# EAGLE design ESP8223_Releay Board (EAGLE 8.3.2)
Moduł wykonawczy sterowania akwarium
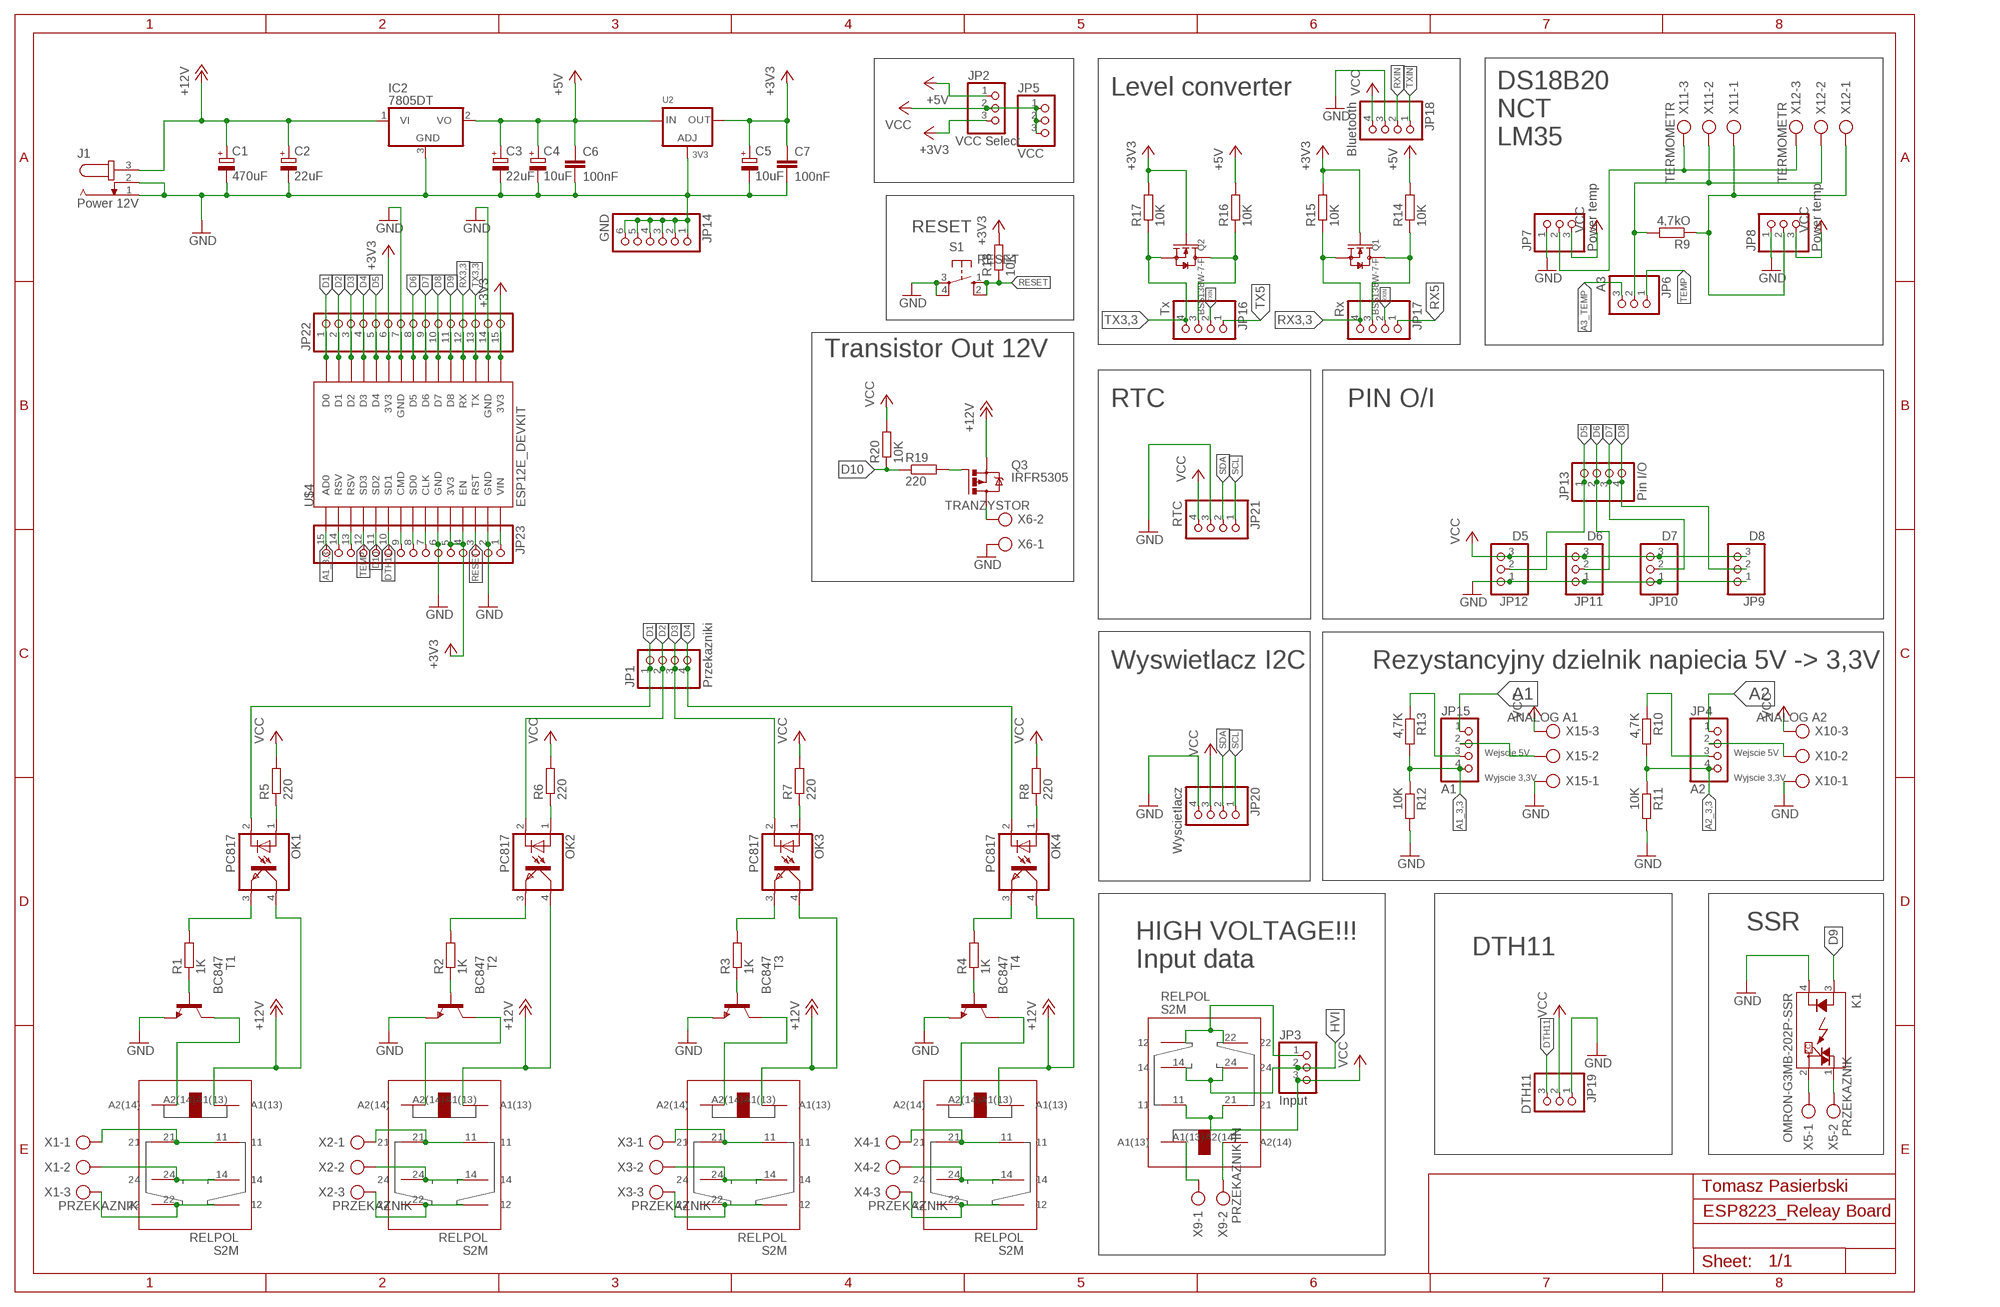
[diagram p0: schematic, sheet 1]

## Parts
C1  470uF  CPOL-EUE5-8.5  [E5-8,5]
C2  22uF  CPOL-EUE2.5-6  [E2,5-6]
C3  22uF  CPOL-EUE2.5-6  [E2,5-6]
C4  10uF  CPOL-EU153CLV-0810  [153CLV-0810]
C5  10uF  CPOL-EU153CLV-0810  [153CLV-0810]
C6  100nF  C-EUC1206K  [C1206K]
C7  100nF  C-EUC1206K  [C1206K]
IC2  7805DT  [TO252]
J1  Power 12V  JACK-PLUG0  [SPC4077]
JP1  Przekazniki  PINHD-1X4  [1X04]
JP2  VCC Select  PINHD-1X3  [1X03]
JP3  Input  PINHD-1X3  [1X03]
JP4  A2  PINHD-1X4  [1X04]
JP5  VCC  PINHD-1X3  [1X03]
JP6  A3  PINHD-1X3  [1X03]
JP7  Power temp  PINHD-1X3  [1X03]
JP8  Power temp  PINHD-1X3  [1X03]
JP9  D8  PINHD-1X3  [1X03]
JP10  D7  PINHD-1X3  [1X03]
JP11  D6  PINHD-1X3  [1X03]
JP12  D5  PINHD-1X3  [1X03]
JP13  Pin I/O  PINHD-1X4  [1X04]
JP14  GND  PINHD-1X6  [1X06]
JP15  A1  PINHD-1X4  [1X04]
JP16  Tx  PINHD-1X4  [1X04]
JP17  Rx  PINHD-1X4  [1X04]
JP18  Bluetooth  PINHD-1X4  [1X04]
JP19  DTH11  PINHD-1X3  [1X03]
JP20  Wyscietlacz  PINHD-1X4  [1X04]
JP21  RTC  PINHD-1X4  [1X04]
JP22  PINHD-1X15  [1X15]
JP23  PINHD-1X15  [1X15]
K1  OMRON-G3MB-202P-SSR  [OMRON-G3MB-202P-SSR]
OK1  PC817  [DIL04]
OK2  PC817  [DIL04]
OK3  PC817  [DIL04]
OK4  PC817  [DIL04]
Q1  BSS138W-7-F  SMD-MOSFET-N-CH-50V-200MA-BSS138W-7-F(SOT-23)  [SOT-23]
Q2  BSS138W-7-F  SMD-MOSFET-N-CH-50V-200MA-BSS138W-7-F(SOT-23)  [SOT-23]
Q3  IRFR5305  [D-PAK_TO252AA]
R1  1K  R-EU_R1206W  [R1206W]
R2  1K  R-EU_R1206W  [R1206W]
R3  1K  R-EU_R1206W  [R1206W]
R4  1K  R-EU_R1206W  [R1206W]
R5  220  R-EU_R1206W  [R1206W]
R6  220  R-EU_R1206W  [R1206W]
R7  220  R-EU_R1206W  [R1206W]
R8  220  R-EU_R1206W  [R1206W]
R9  4,7kO  R-EU_R1206W  [R1206W]
R10  4,7K  R-EU_R1206W  [R1206W]
R11  10K  R-EU_R1206W  [R1206W]
R12  10K  R-EU_R1206W  [R1206W]
R13  4,7K  R-EU_R1206W  [R1206W]
R14  10K  R-EU_R1206W  [R1206W]
R15  10K  R-EU_R1206W  [R1206W]
R16  10K  R-EU_R1206W  [R1206W]
R17  10K  R-EU_R1206W  [R1206W]
R18  10K  R-EU_R1206W  [R1206W]
R19  220  R-EU_R1206W  [R1206W]
R20  10K  R-EU_R1206W  [R1206W]
S1  RESET  40-XX  [B3F-40XX]
T1  BC847  [SOT23]
T2  BC847  [SOT23]
T3  BC847  [SOT23]
T4  BC847  [SOT23]
U2  3V3  LM1117SOT223-WAVE  [SOT223-W]
U4  RELPOL_S2M  [S2M]
U$1  RELPOL_S2M  [S2M]
U$2  RELPOL_S2M  [S2M]
U$3  RELPOL_S2M  [S2M]
U$4  ESP12E_DEVKIT  [ESP12E_DEVKIT]
U$5  RELPOL_S2M  [S2M]
X1  PRZEKAZNIK  AK300/3  [AK300/3]
X2  PRZEKAZNIK  AK300/3  [AK300/3]
X3  PRZEKAZNIK  AK300/3  [AK300/3]
X4  PRZEKAZNIK  AK300/3  [AK300/3]
X5  PRZEKAZNIK  AK300/2  [AK300/2]
X6  TRANZYSTOR  AK300/2  [AK300/2]
X9  PRZEKAZNIK IN  AK300/2  [AK300/2]
X10  ANALOG A2  AK300/3  [AK300/3]
X11  TERMOMETR  AK300/3  [AK300/3]
X12  TERMOMETR  AK300/3  [AK300/3]
X15  ANALOG A1  AK300/3  [AK300/3]

## Nets
+3V3: C5.+ C7.1 JP2.3 JP22.6 JP22.15 JP23.4 JP23.5 Q1.1(G) Q2.1(G) R15.2 R17.2 R18.2 U2.2(OUT) U$4.3V3@0(3V3) U$4.3V3@1(3V3) U$4.3V3@2(3V3) U$4.EN
+5V: C3.+ C4.+ C6.1 IC2.2(VO) JP2.1 R14.2 R16.2 U2.3(IN)
+12V: C1.+ C2.+ IC2.1(VI) J1.3 OK1.4(COL) OK2.4(COL) OK3.4(COL) OK4.4(COL) Q3.3(S) U4.A1(13) U$1.A1(13) U$2.A1(13) U$3.A1(13)
A1: JP15.1
A1_3,3: JP15.4 JP23.15 R12.1 R13.2 U$4.AD0
A2: JP4.1
A2_3,3: JP4.4 R10.2 R11.1
A3_TEMP: JP6.3
D1: JP1.1 JP22.1 OK1.2(C) U$4.D0
D2: JP1.2 JP22.2 OK2.2(C) U$4.D1
D3: JP1.3 JP22.3 OK3.2(C) U$4.D2
D4: JP1.4 JP22.4 OK4.2(C) U$4.D3
D5: JP12.2 JP13.1 JP22.5 U$4.D4
D6: JP11.2 JP13.2 JP22.8 U$4.D5
D7: JP10.2 JP13.3 JP22.9 U$4.D6
D8: JP9.2 JP13.4 JP22.10 U$4.D7
D9: JP22.11 K1.3(A) U$4.D8
D10: JP23.11 R19.1 R20.1 U$4.SD2
DTH11: JP19.3 JP23.10 U$4.SD1
GND: C1.- C2.- C3.- C4.- C5.- C6.2 C7.2 IC2.3(GND) J1.1 J1.2 JP7.1 JP8.1 JP9.1 JP10.1 JP11.1 JP12.1 JP14.1 JP14.2 JP14.3 JP14.4 JP14.5 JP14.6 JP18.3 JP19.1 JP20.4 JP21.3 JP22.7 JP22.14 JP23.2 JP23.6 K1.4(K) R11.2 R12.2 S1.3(P) S1.4(P1) T1.2(E) T2.2(E) T3.2(E) T4.2(E) U2.1(ADJ) U$4.GND@0(GND) U$4.GND@1(GND) U$4.GND@2(GND) U$4.GND@3(GND) X6.1 X10.1 X15.1
HVI: JP3.2 U$5.14 U$5.24
N$1: JP23.1 U$4.VIN
N$2: Q3.1(G) R19.2
N$3: JP23.7 U$4.CLK
N$4: JP23.8 U$4.SD0
N$5: OK1.1(A) R5.1
N$6: OK2.1(A) R6.1
N$7: OK3.1(A) R7.1
N$8: OK4.1(A) R8.1
N$9: JP3.1 U$5.12 U$5.22
N$10: T2.3(C) U$1.A2(14)
N$11: T3.3(C) U$2.A2(14)
N$12: T4.3(C) U$3.A2(14)
N$13: JP23.9 U$4.CMD
N$14: T1.3(C) U4.A2(14)
N$15: JP4.2 X10.2
N$16: JP23.13 U$4.RSV@1(RSV)
N$17: U$5.A1(13) X9.1
N$18: R1.1 T1.1(B)
N$19: R2.1 T2.1(B)
N$20: R3.1 T3.1(B)
N$21: R4.1 T4.1(B)
N$22: OK1.3(EMIT) R1.2
N$23: OK2.3(EMIT) R2.2
N$24: OK3.3(EMIT) R3.2
N$25: OK4.3(EMIT) R4.2
N$26: U$5.A2(14) X9.2
N$27: JP15.2 X15.2
N$28: JP23.14 U$4.RSV@0(RSV)
N$29: U$3.11 U$3.21 X4.1
N$31: JP17.3 Q1.3(D) R14.1
N$32: U$3.14 U$3.24 X4.2
N$33: U$3.12 U$3.22 X4.3
N$35: Q3.4(D) X6.2
N$36: JP16.3 Q2.3(D) R16.1
N$37: JP7.2 X11.3 X12.3
N$38: U4.11 U4.21 X1.1
N$39: U4.14 U4.24 X1.2
N$40: U4.12 U4.22 X1.3
N$41: K1.2(DS2) X5.1
N$43: K1.1(DS1) X5.2
N$44: U$1.11 U$1.21 X2.1
N$45: U$1.14 U$1.24 X2.2
N$46: U$1.12 U$1.22 X2.3
N$50: U$2.11 U$2.21 X3.1
N$51: U$2.14 U$2.24 X3.2
N$52: U$2.12 U$2.22 X3.3
N$56: JP6.2 R9.2 X11.2 X12.2
N$57: JP8.2 R9.1 X11.1 X12.1
N$67: JP4.3 R10.1
N$68: JP15.3 R13.1
RESET: JP23.3 R18.1 S1.1(S) S1.2(S1) U$4.RST
RX3,3: JP17.4 JP22.12 Q1.2(S) R15.1 U$4.RX
RX5: JP17.1
RXIN: JP17.2 JP18.2
SCL: JP20.1 JP21.1
SDA: JP20.2 JP21.2
TEMP: JP6.1 JP23.12 U$4.SD3
TX3,3: JP16.4 JP22.13 Q2.2(S) R17.1 U$4.TX
TX5: JP16.1
TXIN: JP16.2 JP18.1
VCC: JP2.2 JP3.3 JP5.1 JP5.2 JP5.3 JP7.3 JP8.3 JP9.3 JP10.3 JP11.3 JP12.3 JP18.4 JP19.2 JP20.3 JP21.4 R5.2 R6.2 R7.2 R8.2 R20.2 U$5.11 U$5.21 X10.3 X15.3

## Notes on the sheet
- Level converter
- DS18B20
  NCT
  LM35
- RESET
- Transistor Out 12V
- RTC | PIN O/I
- Wyswietlacz I2C | Rezystancyjny dzielnik napiecia 5V -> 3,3V
- Wejscie 5V | Wejscie 5V
- Wyjscie 3,3V | Wyjscie 3,3V
- SSR
- DTH11
- HIGH VOLTAGE!!!
  Input data
- Tomasz Pasierbski

## Library data of the parts
C1-C5 = rcl:CPOL-EU: POLARIZED CAPACITOR, European symbol
C6 C7 = rcl:C-EU: CAPACITOR, European symbol
IC2 = linear:78*: Positive VOLTAGE REGULATOR Source: http://cache.national.com/ds/LM/LM78L05.pdf http://www.fairchildsemi.com/ds/LM/LM7805.pdf
J1 = con-jack:JACK-PLUG: DC POWER JACK Power Jack, DC, Right Angle, Through Hole, Rated 5A at 16VDC, PC Terminals Distributor: Farnell (www.Farnell.de) Drawing: 84N1161.pdf / 84N1162.pdf Manufacturer: SPC Technology (www.spctechnology.com) Type: SPC4077 / SPC 4078; OC_FARNELL: unknown; OC_NEWARK: unknown
JP1 JP4 JP13 JP15-JP18 JP20 JP21 = pinhead:PINHD-1X4: PIN HEADER
JP2 JP3 JP5-JP12 JP19 = pinhead:PINHD-1X3: PIN HEADER
JP14 = pinhead:PINHD-1X6: PIN HEADER
JP22 JP23 = pinhead:PINHD-1X15: PIN HEADER
K1 = Omron G3MB 202p SSR:OMRON-G3MB-202P-SSR: IT(rms) 8A, Zero Cross type SIP 4pin Triac output SSR Source: http://sharp-world.com/products/device/lineup/data/pdf/datasheet/s102s02_e.pdf
OK1-OK4 = optocoupler:PC817: SHARP OPTO COUPLER; MPN: PC817X4J000F; OC_FARNELL: 9707727; OC_NEWARK: 97K7059
Q1 Q2 = Seeed-Transistor:SMD-MOSFET-N-CH-50V-200MA-BSS138W-7-F(SOT-23): 305030000; MPN: BSS138W-7-F
Q3 = transistor-power:IRF?5305: HEXFET Power MOSFET Source: http://www.irf.com/product-info/datasheets/data/irfr5305pbf.pdf
R1-R20 = rcl:R-EU_: RESISTOR, European symbol
S1 = adafruit:40-XX: OMRON SWITCH; MF: OMRON COMPONENTS USA; MPN: B3F-4000; OC_FARNELL: 176434; OC_NEWARK: 36K3105
T1-T4 = transistor:BC847: NPN TRANSISTOR
U2 = microbuilder:LM1117: LM1117 Voltage Regulator LM1117 Adjustable Voltage regulator [Digikey: LM1117IMP-ADJDKR-ND] LM1117 3.3V Voltage regulator [AP1117E33GDIDKR-ND] LM1117 5.0V Voltage regulator [AP1117E50GDIDKR-ND] SOT223-REFLOW - SOT223 package for solder paste/reflow ovens SOT223-WAVE - SOT223 package for hand-soldering (larger pads) Note: For the fixed-voltage regulators, simply set the ADJ pin to GND.
U4 U$1-U$3 U$5 = Relpol_S2M:RELPOL_S2M
U$4 = ESP12E_DEVKIT:ESP12E_DEVKIT: ESP12E DEVKIT BOARD
X1-X4 X10-X12 X15 = con-ptr500:AK300/3: CONNECTOR; OC_FARNELL: unknown; OC_NEWARK: unknown
X5 X6 X9 = con-ptr500:AK300/2: CONNECTOR; OC_FARNELL: unknown; OC_NEWARK: unknown

## Board
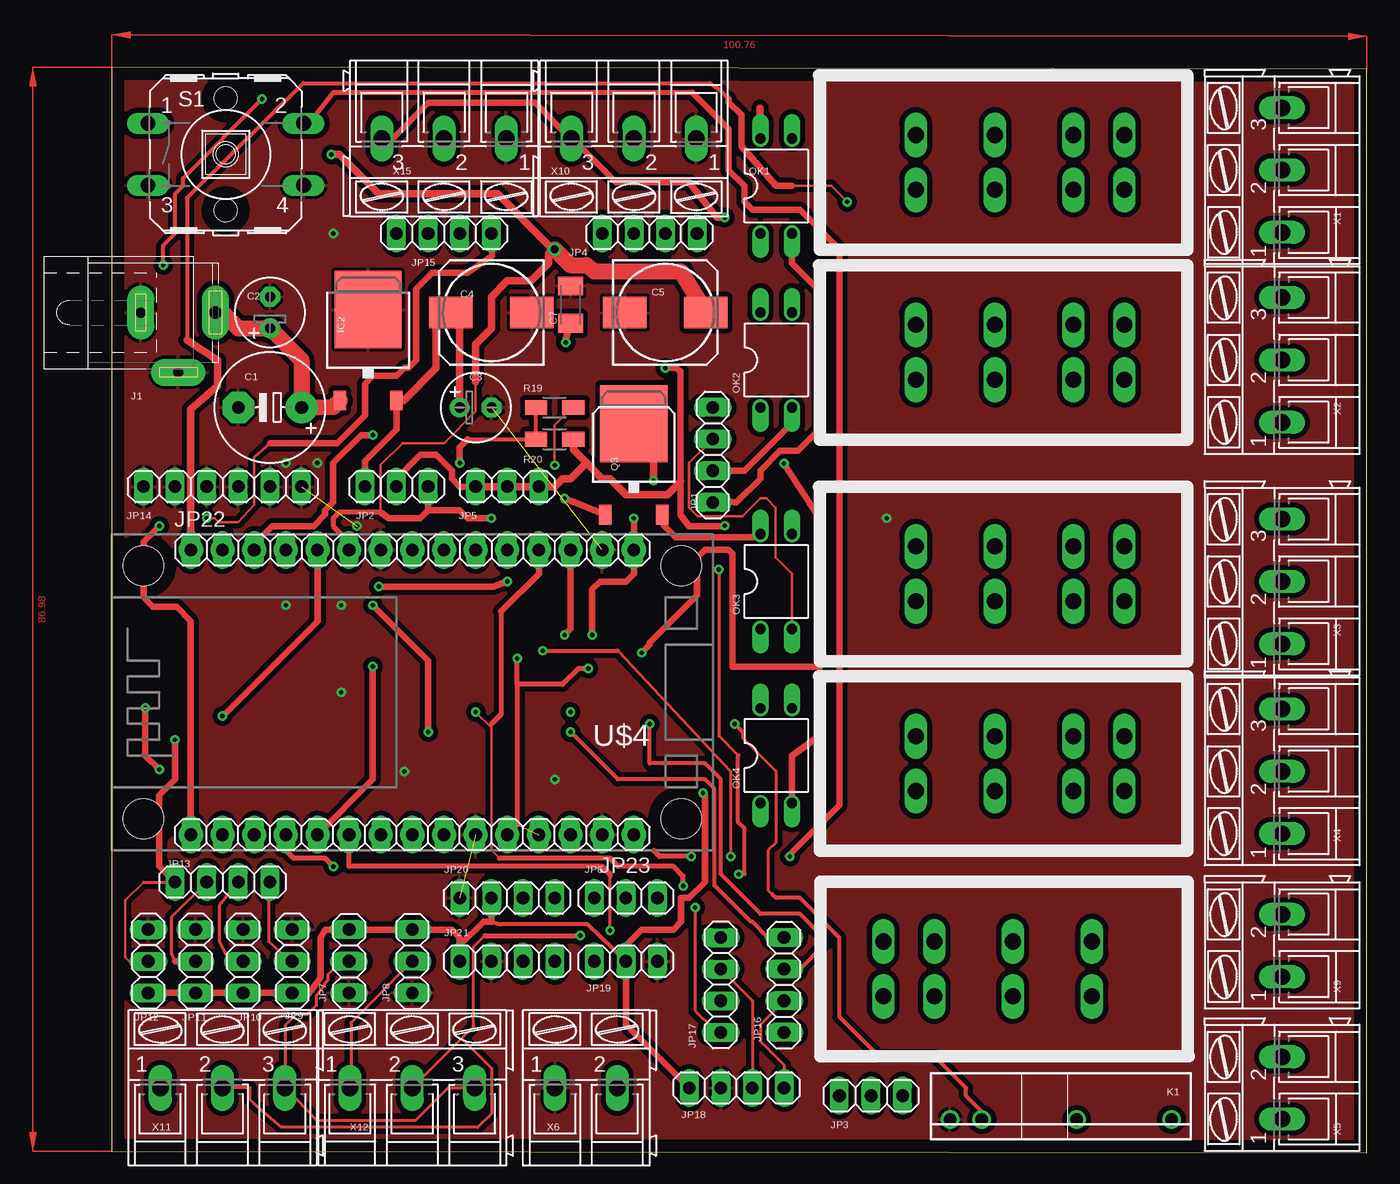
[diagram p1: board, top side]
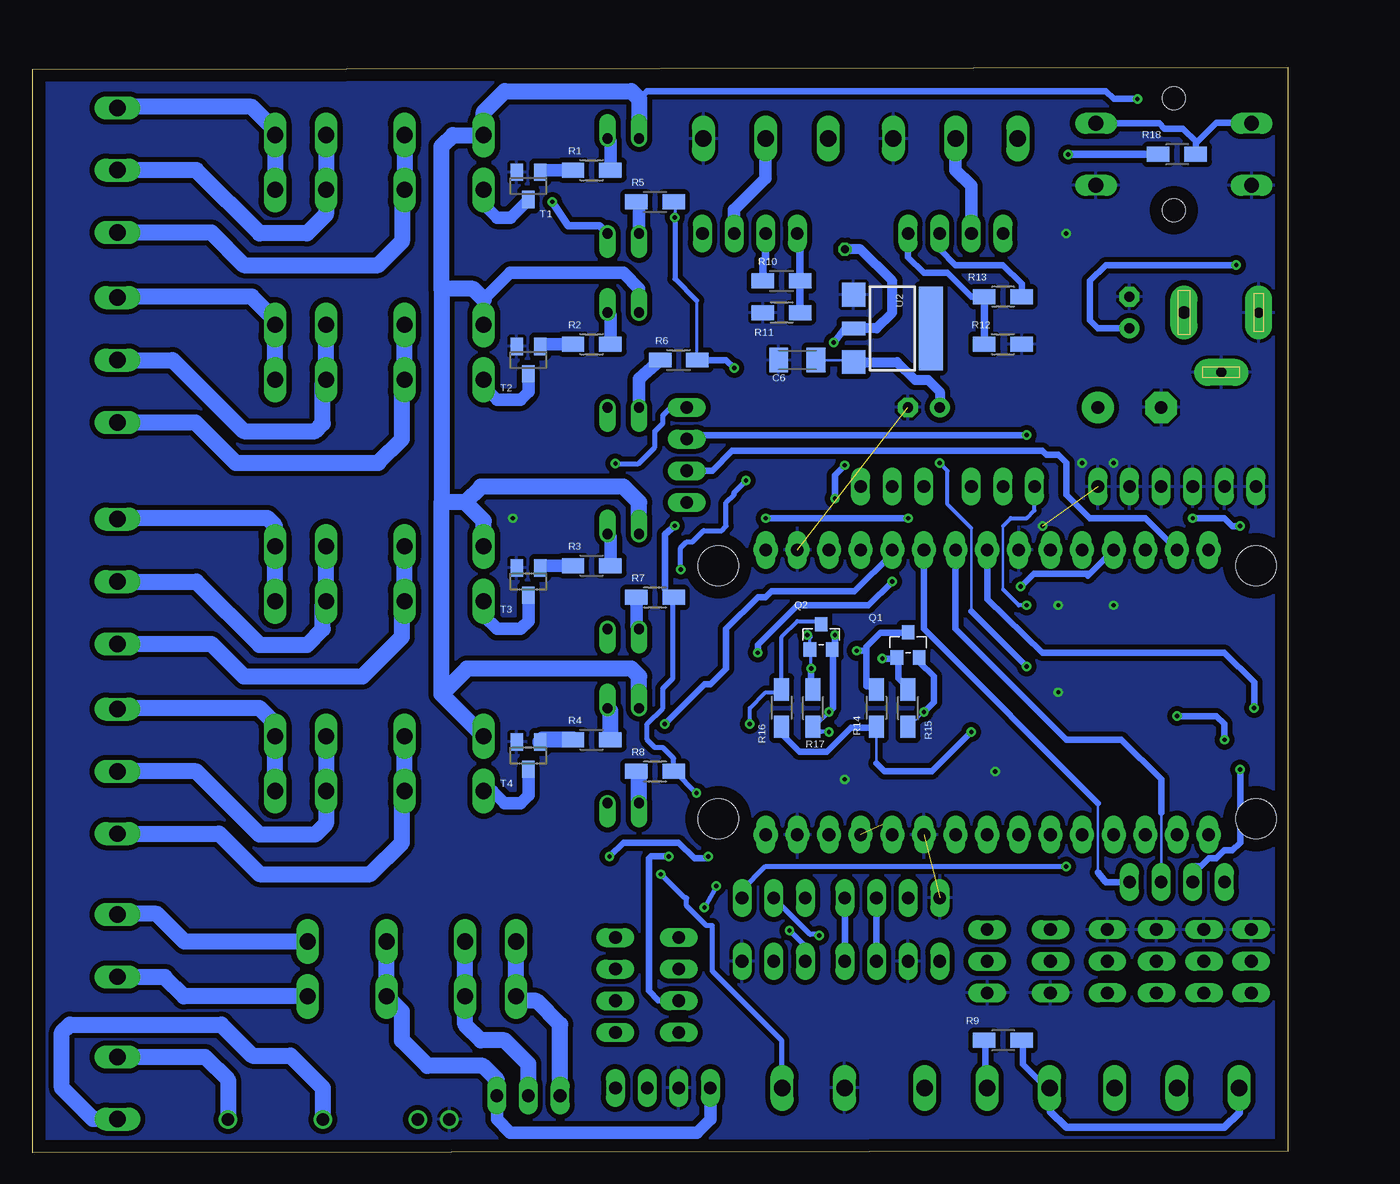
[diagram p2: board, bottom side, seen from below]

Size 100.76 x 87.11 mm. Coordinates in mm from the lower left corner, seen from the top.
Outline: 0,0.13 100.76,0 100.76,86.98 0,87.11 0,0.13
Copper layers (1*16): Top 0.035mm / dielectric 1.5mm / Bottom 0.035mm
Design rules "default *": minimum track width 8mil, minimum drill 0.35mm, track to track 8mil, track to pad 8mil, pad to pad 8mil, via to via 8mil, smd to smd 8mil, copper to edge 40mil, drill to drill 12mil, minimum pad ring 10mil, minimum via ring 8mil, stop-mask expansion 4mil, vias tented up to drill 0mil, thermal gap 10mil

### Footprints (pad centres in the part's own frame; a part is rotated, then mirrored left to right if it is on the bottom)
E5-8,5 = drill 1.016 pad 2.54: + -2.54,0 | drill 1.016 pad 2.54 octagon: - 2.54,0
E2,5-6 = drill 0.813 pad 1.6: + -1.27,0 | drill 0.813 pad 1.6 octagon: - 1.27,0
153CLV-0810 = smd 3.5 x 2.5: + 3.25,0; - -3.25,0
C1206K = smd 1.5 x 2: 1 -1.5,0; 2 1.5,0
TO252 = smd 1 x 1.6: 1 -2.28,-4.8; 2 2.28,-4.8 | smd 5.4 x 6.2: 3 0,2.5
SPC4077 = drill 0.8 pad 2.184 long: 1 -3,0; 2 0,-4.8 | drill 1 pad 2.184 long: 3 3,0
1X04 = drill 1.016 long: 1 -3.81,0; 2 -1.27,0; 3 1.27,0; 4 3.81,0
1X03 = drill 1.016 long: 1 -2.54,0; 2 0,0; 3 2.54,0
1X06 = drill 1.016 long: 1 -6.35,0; 2 -3.81,0; 3 -1.27,0; 4 1.27,0; 5 3.81,0; 6 6.35,0
1X15 = drill 1.016 long: 1 -17.78,0; 2 -15.24,0; 3 -12.7,0; 4 -10.16,0; 5 -7.62,0; 6 -5.08,0; 7 -2.54,0; 8 0,0; 9 2.54,0; 10 5.08,0; 11 7.62,0; 12 10.16,0; 13 12.7,0; 14 15.24,0; 15 17.78,0
OMRON-G3MB-202P-SSR = drill 1: 1 -10.16,0; 2 -2.54,0; 3 5.08,0; 4 7.62,0
DIL04 = drill 0.813 offset: 1 -1.27,-3.81; 2 1.27,-3.81; 3 1.27,3.81; 4 -1.27,3.81
SOT-23 = smd 1.016 x 1.143: 1 -0.889,-1.016; 2 0.889,-1.016; 3 0,1.016
D-PAK_TO252AA = smd 1 x 1.6: 1 -2.28,-4.8; 3 2.28,-4.8 | smd 5.4 x 6.2: 4 0,2.5
R1206W = smd 1.8 x 1.2: 1 -1.499,0; 2 1.499,0
B3F-40XX = drill 1.194 long: 1 -6.248,2.489; 2 6.248,2.489; 3 -6.248,-2.489; 4 6.248,-2.489 | hole 1.803: 0,-4.496; 0,4.496
SOT23 = smd 1 x 1.4: 1 -0.95,-1.1; 2 0.95,-1.1; 3 0,1.1
SOT223-W = smd 1.9 x 1.9: 1 -2.7,-3.1; 3 2.7,-3.1 | smd 1.1 x 1.9: 2 0,-3.1 | smd 6.7 x 1.9: 4 0,3.1
S2M = drill 1.3 long: 11 4.8,-15.45; 12 4.8,-5.05; 14 4.8,-9.15; 21 9.2,-15.45; 22 9.2,-5.05; 24 9.2,-9.15; A1(13) 4.8,-21.8; A2(14) 9.2,-21.8
ESP12E_DEVKIT = drill 0.8 pad 1.93: 3V3@0 -11.43,-7.62; 3V3@1 11.43,5.08; 3V3@2 11.43,-17.78; AD0 -11.43,17.78; CLK -11.43,-2.54; CMD -11.43,2.54; D0 11.43,17.78; D1 11.43,15.24; D2 11.43,12.7; D3 11.43,10.16; D4 11.43,7.62; D5 11.43,0; D6 11.43,-2.54; D7 11.43,-5.08; D8 11.43,-7.62; EN -11.43,-10.16; GND@0 -11.43,-5.08; GND@1 -11.43,-15.24; GND@2 11.43,2.54; GND@3 11.43,-15.24; RST -11.43,-12.7; RSV@0 -11.43,15.24; RSV@1 -11.43,12.7; RX 11.43,-10.16; SD0 -11.43,0; SD1 -11.43,5.08; SD2 -11.43,7.62; SD3 -11.43,10.16; TX 11.43,-12.7; VIN -11.43,-17.78 | hole 3.2: -10.16,21.59; 10.16,21.59; 10.16,-21.59; -10.16,-21.59
AK300/3 = drill 1.321 long: 1 -5.004,0; 2 0,0; 3 5.004,0
AK300/2 = drill 1.321 long: 1 -2.515,0; 2 2.489,0

### Placement (x,y rotation side)
C1  12.7,59.82 180 top
C2  12.7,67.44 90 top
C3  29.21,59.82 0 top
C4  30.48,67.44 180 top
C5  44.45,67.44 0 top
C6  39.37,63.63 180 bottom
C7  36.83,68.07 90 top
IC2  20.58,65.18 0 top
J1  5.33,67.44 0 top
JP1  48.26,56.01 90 top
JP2  22.86,53.47 0 top
JP3  60.96,4.57 0 top
JP4  43.18,73.79 180 top
JP5  31.75,53.47 0 top
JP6  41.27,20.45 180 top
JP7  19.05,15.37 90 top
JP8  24.13,15.37 90 top
JP9  14.48,15.37 270 top
JP10  10.54,15.37 270 top
JP11  6.73,15.37 270 top
JP12  2.92,15.37 270 top
JP13  8.89,21.72 0 top
JP14  8.89,53.47 0 top
JP15  26.67,73.79 0 top
JP16  53.98,13.46 90 top
JP17  48.9,13.46 270 top
JP18  50.16,5.21 180 top
JP19  41.27,15.37 180 top
JP20  31.75,20.45 180 top
JP21  31.75,15.37 180 top
JP22  24.13,48.39 0 top
JP23  24.13,25.53 180 top
K1  74.93,2.67 180 top
OK1  53.34,77.6 0 top
OK2  53.34,63.63 0 top
OK3  53.34,45.85 0 top
OK4  53.34,31.88 0 top
Q1  30.48,40.77 0 bottom
Q2  37.47,41.4 0 bottom
Q3  41.91,56.01 0 top
R1  55.88,78.87 0 bottom
R2  55.88,64.9 0 bottom
R3  55.88,47.12 0 bottom
R4  55.88,33.15 0 bottom
R5  50.8,76.33 0 bottom
R6  48.9,63.63 0 bottom
R7  50.8,44.58 0 bottom
R8  50.8,30.61 0 bottom
R9  22.86,9.02 180 bottom
R10  40.64,69.98 0 bottom
R11  40.64,67.44 180 bottom
R12  22.86,64.9 0 bottom
R13  22.86,68.71 180 bottom
R14  33.02,35.69 270 bottom
R15  30.48,35.69 90 bottom
R16  40.64,35.69 270 bottom
R17  38.1,35.69 90 bottom
R18  8.89,80.14 180 bottom
R19  35.56,59.82 0 top
R20  35.56,57.28 0 top
S1  9.14,80.14 0 top
T1  60.96,77.6 180 bottom
T2  60.96,63.63 180 bottom
T3  60.96,45.85 180 bottom
T4  60.96,31.88 180 bottom
U2  31.75,66.17 270 bottom
U4  86.36,86.49 270 top
U$1  86.36,71.25 270 top
U$2  86.36,53.47 270 top
U$3  86.36,38.23 270 top
U$4  24.13,36.96 90 top
U$5  56.9,7.75 90 top
X1  93.98,78.87 90 top
X2  93.98,63.63 90 top
X3  93.98,45.85 90 top
X4  93.98,30.61 90 top
X5  93.98,5.21 90 top
X6  38.1,5.21 0 top
X9  93.98,16.64 90 top
X10  41.91,81.41 180 top
X11  8.89,5.21 0 top
X12  24.13,5.21 0 top
X15  26.67,81.41 180 top

### Tracks (layer width: path | path; a pad name or v marks a point on that pad's centre or on a via)
+3V3  (via drill 0.35, 0.65)  (1 unrouted)
  Top 0.203: 29.21,61.88 29.21,59.5 26.67,56.96 23.37,56.96 21.6,55.21 21.6,51.4 | 35.08,72.2 v35.56,72.52
  Top 0.305: 41.91,49.02 U$4.3V3@2
  Top 0.406: 32.54,37.59 32.54,26.32 U$4.3V3@0 | 32.54,37.59 v32.54,39.66 | v38.26,38.86 37.47,38.86 36.2,37.59 32.54,37.59 | 21.6,51.4 18.26,51.4 17.78,50.93 17.78,50.29 18.41,49.66 18.92,49.66 19.05,49.53
  Top 0.508: v38.58,41.56 38.58,45.21 39.21,45.85 41.27,45.85 41.91,46.48 U$4.3V3@2 v41.91,50.93 | v36.45,65.02 36.45,65.25 C7.1 | 19.05,49.53 U$4.3V3@1 | 25.4,51.56 24.77,50.93 22.23,50.93 21.6,51.4 | 25.4,51.56 JP2.3 | v30.48,50.93 28.57,50.93 27.94,51.56 25.4,51.56
  Top 0.61: v17.62,80.14 18.26,80.14 21.43,76.96 30.96,76.96 35.08,72.83 v35.56,72.52 | 29.21,61.88 29.21,64.9 30.48,66.17 30.48,68.71 31.75,69.98 33.66,69.98 35.08,71.41 35.08,72.2
  Top 1.27: v35.56,72.52 36.83,71.25 38.1,71.25 38.73,70.74 45.66,70.74 C5.+
  Bottom 0.203: 38.26,37.43 38.1,37.28 R17.2 | 31.27,39.66 Q1.1
  Bottom 0.254: v38.26,38.86 38.26,40.29 Q2.1 38.42,40.45 38.42,41.4 | 30.48,37.28 R15.2 | 31.43,39.66 Q1.1
  Bottom 0.508: 38.26,37.43 v38.26,38.86 | 31.27,39.66 31.27,38.07 30.48,37.28 | v32.54,39.66 31.43,39.66 | v38.58,41.56 38.42,41.4 | U2.2 35.56,66.17 v36.45,65.02 | v41.91,50.93 v30.48,50.93
  Bottom 0.61: v17.62,80.14 R18.2
  Bottom 0.813: U2.2 33.02,66.17 31.75,67.44 31.75,69.98 34.29,72.52 v35.56,72.52
+5V  (via drill 0.35)
  Top 0.508: IC2.2 22.86,58.07 20.32,55.53 JP2.1 | v25.4,33.78 25.4,39.5 v20.95,43.94
  Top 0.61: IC2.2 23.42,60.38 26.04,62.99 26.04,66.24 C4.+ | 27.23,66.88 27.94,66.17 C3.+
  Top 1.27: C4.+ 27.23,66.88
  Bottom 0.203: 33.02,34.1 R14.2 33.02,31.24 | C6.1 35.4,63.63 U2.3 | 22.86,45.21 22.86,50.29
  Bottom 0.305: v20.95,43.94 21.59,43.94 22.86,45.21 | 22.86,50.29 22.23,50.93 20.95,50.93 20.32,51.56 JP2.1
  Bottom 0.508: 33.02,34.1 35.08,34.1 36.99,32.2 39.21,32.2 40.64,33.62 R16.2 | 33.02,31.24 32.38,30.61 28.57,30.61 v25.4,33.78
  Bottom 0.813: U2.3 31.36,63.47 29.93,62.03 28.88,62.03 27.94,61.09 C3.+
+12V  (via drill 0.35)
  Top 0.203: 44.32,50.32 44.29,51.09 Q3.3
  Top 0.305: v4.13,71.25 4.13,72.83 5.08,73.79 5.08,76.96 5.71,77.6 5.71,78.23 v12.06,84.58
  Top 0.508: 44.32,50.32 45.24,49.4 51.82,49.4 OK3.4
  Top 0.61: 52.04,83.82 OK1.4
  Top 1.27: J1.3 8.89,67.44 10.16,66.17 C2.+ 15.24,63.63 C1.+ 16.51,59.82 17.78,59.86 IC2.1
  Bottom 0.254: 7.94,67.44 J1.3
  Bottom 0.508: C2.+ 15.24,66.17 15.88,66.8 15.88,69.98 14.61,71.25 v4.13,71.25 | v12.06,84.58 13.97,84.58 14.61,85.22 51.44,85.22 52.07,84.58
  Bottom 1.016: U$1.A1(13) 64.56,68.5 62.45,70.61 53.34,70.61 52.07,69.34 OK2.4
  Bottom 1.27: 67.94,69.34 67.94,52.2 | 67.94,69.34 67.94,80.77 67.03,81.69 U4.A1(13) 64.56,83.52 62.87,85.22 52.7,85.22 52.07,84.58 OK1.4 | 67.94,36.81 67.94,52.2 | 67.94,36.81 U$3.A1(13) | U$2.A1(13) 64.56,50.72 66.04,52.2 | 66.04,52.2 67.94,52.2 | 64.56,68.5 65.41,69.34 67.94,69.34 | OK3.4 52.07,52.2 53.34,53.47 64.77,53.47 66.04,52.2 | OK4.4 52.07,38.23 52.7,38.86 65.89,38.86 67.94,36.81
A1_3,3  (via drill 0.35)
  Top 0.203: 12.7,56.96 11.44,55.82 11.44,52.01 10.16,50.61 8.57,50.61 8.26,50.93 v7.62,50.93
  Top 0.508: JP15.4 30.54,72.01 28.57,70.61 25.72,70.61 24.45,69.34 24.45,63.63 23.81,62.99 23.5,62.99 22.86,62.36 20.95,62.36 20.32,61.72 20.32,59.18 18.1,56.96 12.7,56.96 | U$4.AD0 6.35,42.67 5.2,43.82 3.3,43.82 2.54,44.58 2.54,49.02 v3.81,50.29
  Bottom 0.508: R13.2 25.4,68.71 27.3,70.61 29.21,70.61 30.48,71.88 JP15.4 | v3.81,50.29 4.45,50.29 5.08,50.93 v7.62,50.93
  Bottom 0.61: R13.2 R12.1
A2_3,3
  Bottom 0.61: R11.1 R10.2 39.14,72.92 39.37,73.15 JP4.4
D1  (via drill 0.35)
  Top 0.203: v59.05,76.33 57.78,77.6 54.61,77.6
  Top 0.305: 49.53,84.58 48.87,85.24 48.91,85.24 47.99,85.85 15.37,85.85 6.03,76.64 6.03,65.21
  Top 0.508: OK1.2 54.61,71.41 56.83,69.18 56.83,58.07 55.09,56.32 53.66,56.32 52.07,54.74 52.07,54.1 50.16,52.2 JP1.1 | 54.61,77.6 53.34,77.6 50.55,80.77 50.55,83.31 49.53,84.33 49.53,84.58
  Top 0.61: U$4.D0 6.35,59.66 8.51,61.56 8.51,63.63 6.03,65.21
  Bottom 0.61: OK1.2 55.24,74.42 57.78,74.42 v59.05,76.33
D2
  Top 0.508: JP1.2 50.8,54.74 54.61,58.55 OK2.2
  Bottom 0.508: U$4.D1 11.43,50.93 15.88,50.93 17.78,52.83 17.78,55.37 18.41,56.01 19.37,56.01 19.68,56.32 44.61,56.32 46.2,54.74 JP1.2
D3  (via drill 0.35)
  Top 0.203: OK3.2 54.61,46.48 53.28,47.82 53.28,51.78 52.55,52.52 52.07,52.52 50.64,51.09 47.02,51.09 46.35,51.75 46.35,55.37 JP1.3
  Top 0.508: U$4.D2 11.46,48.9 12.86,50.29 16.19,50.29 17.14,51.24 17.14,51.56 17.78,52.2 17.78,55.37 20,57.6 v20.95,57.6
  Bottom 0.508: v20.95,57.6 47.94,57.6 JP1.3
D4  (via drill 0.35)
  Top 0.203: 43.34,40.93 43.18,40.93
  Top 0.508: OK4.2 54.61,31.88 56.83,33.46 56.83,39.02 | 56.83,39.02 56.83,50.93 v53.98,55.31 | v21.43,45.43 30.67,45.43 31.75,45.88 v31.75,45.85 | 56.83,39.02 49.85,39.02 49.85,48.07 49.53,48.39 47.62,48.39 46.99,47.75 46.99,44.74 43.18,40.93 43.18,40.77 v42.55,40.13
  Bottom 0.406: v53.98,55.31 52.13,55.31 50.8,56.64 50.8,57.91 50.16,58.55 50.16,59.18 49.53,59.82 JP1.4
  Bottom 0.508: 15.88,46.48 U$4.D3 | v21.43,45.43 20.38,46.48 15.88,46.48 | 15.88,46.48 16.03,46.32 | v42.55,40.13 42.55,40.77 39.37,43.94 33.66,43.94 v31.75,45.85
  Bottom 0.61: JP1.4 48.26,59.5
D5  (via drill 0.35)
  Top 0.203: JP12.2 1.4,15.37 1.09,15.67 1.09,20.27 2.54,21.72
  Top 0.254: 2.54,21.72 JP13.1
  Top 0.508: U$4.D4 16.51,42.67 v8.89,35.05 | v5.08,33.15 5.08,29.97 3.81,28.7 3.81,22.99 JP13.1
  Bottom 0.508: v8.89,35.05 5.71,35.05 5.08,34.42 v5.08,33.15
D6  (via drill 0.35)
  Top 0.254: JP13.2 4.83,18.92 4.83,16 5.08,15.37
  Top 0.508: v2.7,35.69 2.7,31.88 v3.81,30.77 | JP11.2 5.08,15.37
  Bottom 0.508: U$4.D5 24.13,44.42 19.68,40.13 5.08,40.13 2.7,37.75 v2.7,35.69 | JP13.2 7.62,22.99 6.99,22.99 6.35,23.62 5.71,23.62 5.08,24.26 4.45,24.26 3.81,24.89 v3.81,30.77
D7
  Top 0.254: JP10.2 9.4,15.43 8.64,16.95 8.64,19.81 JP13.3
  Bottom 0.203: JP13.3 10.16,27.27
  Bottom 0.508: U$4.D6 26.67,42.04 17.78,33.15 13.34,33.15 10.16,29.97 10.16,27.27
D8
  Top 0.254: JP9.2 13.97,15.68 12.57,16.95 12.57,21.08 JP13.4
  Bottom 0.203: 15.24,22.51 15.24,28.07
  Bottom 0.508: U$4.D7 29.21,42.04 15.24,28.07 | JP13.4 14.61,21.72 15.24,22.51
D9  (via drill 0.35)
  Top 0.254: 50.64,33.78 50.64,33.31 53.34,30.61 53.34,24.89 52.7,24.26 52.7,21.08 53.02,20.76
  Top 0.305: v50.01,34.42 50.64,33.78 | K1.3 69.85,3.3 68.58,4.57 68.58,5.21 66.04,7.75 61.59,7.75 58.42,10.92 58.42,17.27 55.24,20.45 53.34,20.45 53.02,20.76
  Bottom 0.508: U$4.D8 31.75,48.07 34.77,45.05 41.43,45.05 41.91,44.58 42.55,44.58 45.09,42.04 45.09,38.86 46.35,37.59 46.83,37.59 v50.01,34.42
D10  (via drill 0.35)
  Top 0.254: R19.1 34.13,59.82
  Top 0.305: 28.57,57.28 R20.1 R19.1
  Top 0.508: v20.95,39.02 20.95,29.97 U$4.SD2 | v27.94,55.37 27.94,56.64 28.57,57.28
  Bottom 0.203: 25.4,43.47 25.4,50.13
  Bottom 0.305: 25.4,50.13 27.3,52.04 27.3,54.74 v27.94,55.37
  Bottom 0.508: v20.95,39.02 25.4,43.47
DTH11  (via drill 0.35)
  Top 0.254: v40.01,17.84 40.01,22.19
  Top 0.406: 40.01,22.19 40.01,22.35 39.37,22.99 19.05,22.99 U$4.SD1
  Bottom 0.406: JP19.3 38.73,16.57 v40.01,17.84
GND  (via drill 0.35)  (3 unrouted)
  other vias: 62.23,50.93 18.41,43.94 13.97,55.37 17.78,73.79 13.97,43.94 18.41,36.96 19.68,50.29 16.51,55.37 23.5,30.61 35.56,29.97
  pour Top (isolate 0.406): -5.08,90.3 106.68,90.3 106.68,-4.95 -5.08,-4.95
  pour Bottom (isolate 0.406): -1.27,87.76 104.14,87.76 104.14,-3.68 -1.27,-3.68
HVI
  Bottom 1.27: U$5.24 U$5.14 66.04,10.29 64.77,9.02 62.87,9.02 60.96,7.11 JP3.2
N$2  (via drill 0.35)
  Top 0.203: v35.56,55.18 35.56,58.39 36.99,59.82 R19.2 | 39.53,51.24 Q3.1
  Top 0.508: v36.35,52.52 39.53,51.24
  Bottom 0.508: v36.35,52.52 36.35,54.39 v35.56,55.18
N$5
  Bottom 1.016: OK1.1 52.07,76.1 R5.1
N$6
  Bottom 1.016: OK2.1 52.07,62.13 R6.1
N$7
  Bottom 1.016: R7.1 52.3,42.27 OK3.1
N$8
  Bottom 1.27: OK4.1 52.07,30.38 R8.1
N$9
  Bottom 1.27: U$5.22 U$5.12 61.59,12.19 60.33,12.19 58.42,10.29 JP3.1
N$10
  Bottom 1.016: 64.56,61.51 63.5,60.45 61.59,60.45 60.96,61.09 T2.3
  Bottom 1.27: U$1.A2(14) 64.56,61.51
N$11
  Bottom 1.016: U$2.A2(14) 64.56,43.1 63.5,42.04 61.59,42.04 60.96,42.67 T3.3
N$12
  Bottom 1.016: U$3.A2(14) 63.83,29.03 62.87,28.07 61.59,28.07 60.96,28.7 T4.3
N$14
  Bottom 1.016: U4.A2(14) 64.56,76.12 63.5,75.06 62.4,75.06 T1.3
N$15
  Bottom 1.016: JP4.2 44.45,75.69 41.91,78.23 X10.2
N$17
  Bottom 1.27: U$5.A1(13) 88.62,12.55 90.17,14.1 93.95,14.1 X9.1
N$18
  Bottom 1.016: R1.1 59.84,78.87 T1.1
N$19
  Bottom 1.016: R2.1 59.84,64.9 T2.1
N$20
  Bottom 1.016: R3.1 59.84,47.12 T3.1
N$21
  Bottom 1.27: R4.1 59.84,33.15 T4.1
N$22
  Bottom 1.016: R1.2 54.38,81.18 OK1.3
N$23
  Bottom 1.016: R2.2 54.38,67.21 OK2.3
N$24
  Bottom 1.016: R3.2 54.38,49.43 OK3.3
N$25
  Bottom 1.27: R4.2 54.38,35.46 OK4.3
N$26
  Bottom 1.27: U$5.A2(14) 88.58,16.95 90.81,19.18 93.93,19.18 X9.2
N$27
  Bottom 1.016: JP15.2 25.4,77.6 26.67,78.87 X15.2
N$29
  Bottom 1.27: U$3.11 U$3.21 71.12,28.82 71.12,24.89 73.66,22.35 82.55,22.35 85.8,25.6 X4.1
N$31  (via drill 0.35)
  Top 0.254: v49.69,23.78 49.69,30.61 40.64,40.29
  Top 0.305: v34.61,40.29 40.64,40.29
  Bottom 0.203: 30.48,41.72 Q1.3 | 33.02,37.28 R14.1
  Bottom 0.508: 30.48,41.72 32.7,41.72 33.81,40.61 33.81,40.29 | 33.81,40.29 33.81,37.43 33.02,37.28 | JP17.3 50.55,12.26 51.28,12.99 51.28,23.62 51.12,23.78 v49.69,23.78 | 33.81,40.29 v34.61,40.29
N$32
  Bottom 1.27: U$3.14 U$3.24 77.21,26.42 78.11,25.53 82.55,25.53 87.63,30.61 X4.2
N$33
  Bottom 1.27: U$3.22 U$3.12 81.31,34.45 82.55,35.69 93.9,35.69 X4.3
N$35  (via drill 0.35)
  Top 0.203: 43.5,56.8 41.91,58.39 Q3.4
  Top 0.254: 50.32,31.88 48.74,33.46 v48.74,46.8
  Top 0.305: v50.32,22.35 50.8,22.35 50.8,26.04 50.29,26.54 50.29,31.84 50.32,31.88
  Top 0.61: 43.5,56.8 v43.5,53.94
  Bottom 0.203: 40.64,5.21 X6.2
  Bottom 0.406: 40.64,5.21 40.64,9.02 46.2,14.57 46.2,18.22 46.67,18.22 48.26,19.81 48.26,20.45 48.42,20.45 v50.32,22.35 | v48.74,46.8 48.74,48.55 48.26,49.02 47.8,49.02 46.89,49.94 45.44,49.94 45.09,50.29 45.09,52.2 44.45,52.83 44.45,52.99 v43.5,53.94
N$36  (via drill 0.35)
  Top 0.305: JP16.3 55.24,14.73 57.15,16.64 57.15,17.27 55.24,19.18 52.07,19.18 48.9,22.35 48.9,29.97 47.62,31.24 43.18,31.24 v43.18,34.42
  Bottom 0.305: Q2.3 37.72,42.67 39.37,42.67 40.64,41.4 R16.1 40.87,36.96 41.91,36.96 43.18,35.69 v43.18,34.42
N$37
  Top 0.254: 13.97,5.21 13.97,10.29 14.78,11.1 15.69,11.1 16.46,11.87 16.46,12.64 17.21,13.72 17.35,13.86 17.38,13.9 17.38,14.33 17.78,14.73 18.41,14.73 JP7.2 | X12.3 26.99,5.21 24.38,2.6 16.45,2.6 13.97,5.21 | 13.97,5.21 X11.3
N$38
  Bottom 1.27: X1.1 86.44,73.86 83.82,71.25 73.03,71.25 71.12,73.15 71.12,77.08 U4.21 U4.11
N$39
  Bottom 1.27: X1.2 87.63,78.87 82.55,73.79 78.74,73.79 77.21,75.32 U4.24 U4.14
N$40
  Bottom 1.27: X1.3 93.9,83.95 83.19,83.95 81.31,82.07 U4.12 U4.22
N$41
  Bottom 1.27: X5.1 95.91,2.69 98.42,5.21 98.42,9.65 97.79,10.29 85.62,10.29 83.13,7.8 80.06,7.8 77.47,5.21 K1.2
N$43
  Bottom 1.27: X5.2 86.94,7.7 85.09,5.84 K1.1
N$44
  Bottom 1.27: U$1.11 U$1.21 71.12,61.84 71.12,57.28 73.03,55.37 84.45,55.37 87.71,58.62 X2.1
N$45
  Bottom 1.27: U$1.14 U$1.24 77.47,61.79 77.47,58.55 78.11,57.91 83.82,57.91 89.53,63.63 X2.2
N$46
  Bottom 1.27: U$1.22 U$1.12 81.31,66.83 83.19,68.71 93.9,68.71 X2.3
N$50
  Bottom 1.27: U$2.11 U$2.21 71.12,44.06 71.12,41.4 74.3,38.23 83.82,38.23 86.44,40.84 X3.1
N$51
  Bottom 1.27: U$2.14 U$2.24 77.47,44.01 77.47,42.04 78.74,40.77 82.55,40.77 87.63,45.85 X3.2
N$52
  Bottom 1.27: U$2.22 U$2.12 81.31,50.32 81.92,50.93 93.9,50.93 X3.3
N$56  (via drill 0.35)
  Top 0.254: 29.94,17.43 29.05,16.54 29.05,10.13 28.1,9.18 | X12.2 28.1,9.18 | X11.2 11.11,5.21 11.11,4.25 11.43,3.94 13.65,2.03 29.37,2.03 30.48,3.14 30.48,6.79 28.1,9.18
  Top 0.406: 29.94,17.43 v37.62,17.43
  Bottom 0.254: X12.2 24.29,5.37 | 24.29,9.02 R9.2
  Bottom 0.406: v37.62,17.43 37.72,17.53 38.35,17.53 JP6.2
  Bottom 0.508: 24.29,5.37 24.29,9.02
N$57
  Top 0.254: JP8.2 19.21,10.45 19.21,5.21 X12.1
  Bottom 0.254: 21.27,9.02 R9.1 | 19.37,5.21 X12.1
  Bottom 0.508: 21.27,9.02 21.27,7.11 19.37,5.21
  Bottom 0.61: X11.1 3.89,3.23 5.08,2.03 17.78,2.03 19.05,3.3 19.05,5.13 X12.1
N$67
  Bottom 0.61: R10.1 42.14,71.65 41.91,71.88 JP4.3
N$68
  Bottom 0.508: R13.1 21.36,69.75 22.86,71.25 26.67,71.25 27.94,72.52 JP15.3
RESET  (via drill 0.35)
  Top 0.203: U$4.RST 37.62,24.26 43.5,24.26
  Top 0.254: 54.29,23.78 v54.45,23.78 | 15.88,82.68 S1.2
  Top 0.406: 43.5,24.26 43.97,23.78 v46.51,23.78 | 46.64,85.09 17.78,85.09 15.88,82.68
  Top 0.508: 54.29,23.78 58.42,27.91 58.42,72.52 55.24,75.69 51.44,75.69 50.8,76.33 50.8,77.6 49.53,78.87 49.53,82.2 46.64,85.09
  Bottom 0.508: R18.1 7.39,81 7.3,81.09 | 7.3,81.09 5.71,82.68 2.69,82.68 | S1.2 10.31,82.63 9.89,82.21 8.42,82.21 7.3,81.09 | v54.45,23.78 53.34,24.89 48.9,24.89 47.62,23.62 46.67,23.62 v46.51,23.78
  Bottom 1.016: 2.69,82.68 S1.1
RX3,3  (via drill 0.35)
  Top 0.203: 30.48,34.1 30.48,34.42 | 30.48,34.1 v29.21,35.37 | 31.11,23.62 30.48,24.26 30.48,34.1
  Top 0.254: JP17.4 48.26,9.97 46.83,11.4 v46.83,19.68
  Top 0.406: 30.48,34.42 31.27,35.21 31.27,43.47 | v45.88,21.4 45.88,22.19 45.09,22.99 40.64,22.99 40.01,23.62 31.11,23.62
  Top 0.508: U$4.RX 34.29,46.48 31.27,43.47
  Bottom 0.203: 29.53,39.34 29.53,39.66 Q1.2 | v29.21,35.37 30.48,34.1 R15.1
  Bottom 0.406: v45.88,21.4 v46.83,19.68
  Bottom 0.508: 29.53,39.34 28.42,38.23 28.42,36.16 v29.21,35.37
RXIN
  Top 0.254: JP18.2 51.44,12.19 JP17.2
SCL
  Bottom 0.508: JP20.1 JP21.1
SDA
  Bottom 0.508: JP20.2 JP21.2
TEMP  (via drill 0.35)
  Top 0.406: v17.78,22.99 17.14,23.62 14.61,23.62 13.97,24.26 U$4.SD3
  Bottom 0.406: JP6.1 43.81,21.08 41.91,22.99 v17.78,22.99
TX3,3  (via drill 0.35)
  Top 0.305: 52.7,17.27 51.44,18.54 51.31,18.54 48.39,21.46 48.39,29.21 47.62,29.97 40.64,29.97 v36.83,33.78
  Top 0.508: U$4.TX 36.83,42.04 v36.35,41.56 | JP16.4 52.7,17.27
  Bottom 0.203: 36.51,40.29 Q2.2 36.35,40.61 | R17.1 38.1,34.1 37.94,34.26
  Bottom 0.305: v36.83,35.37 37.94,34.26 37.47,33.78 v36.83,33.78
  Bottom 0.508: 36.51,40.29 36.51,35.69 v36.83,35.37 | 36.35,40.61 v36.35,41.56
TXIN
  Top 0.254: JP18.1 53.98,7.05 52.07,8.95 52.07,10.29 JP16.2
VCC  (via drill 0.35)
  Top 0.305: JP19.2 38.2,18.32 31.21,18.32 30.48,18.54
  Top 0.508: X15.3 22.54,81.41 25.4,84.27 33.97,84.27 36.83,81.41 X10.3 36.99,81.41 40.48,77.91 46.35,77.91 48.58,75.06 v49.21,75.06 | JP12.3 JP11.3 JP10.3 JP9.3 | 14.29,12.83 JP9.3 | JP18.4 41.27,10.29 41.27,15.21 JP19.2 41.27,16.64 42.55,17.91 45.09,17.91 45.72,18.54 45.72,20.45 46.35,20.45 47.62,21.72 47.62,28.7 v47.47,28.86 | v49.21,50.32 49.05,50.29 46.35,50.29 45.66,51.21 45.65,53.85 45.65,62.74 45.26,62.99 v44.45,62.99 | JP20.3 30.48,18.54 29.84,18.54 27.94,16.64 JP21.4 27.94,17.27 27.3,17.91 JP8.3 JP7.3 17.14,17.91 16.76,17.27 16.76,14.1 15.88,12.83 JP9.3 | JP5.1 27.94,53.47 27.3,54.1 27.3,54.74 26.04,56.01 24.77,56.01 22.86,54.1 JP2.2
  Top 0.61: JP5.1 JP5.2 JP5.3 35.56,53.47 36.2,54.1 36.83,54.1 38.1,55.37 | R20.2 37.06,56.41 38.1,55.37 | 38.1,55.37 39.37,54.1 40.01,54.1 41.27,52.83 44.64,52.83 45.65,53.85
  Bottom 0.203: 49.37,30.92 49.37,30.61 R8.2
  Bottom 0.254: 47.47,68.39 47.47,63.63 R6.2 | v49.21,75.06 49.21,76.33 R5.2 | 49.21,30.61 R8.2 | 50.01,45.21 49.37,44.58 R7.2
  Bottom 0.406: 47.47,68.39 49.21,70.14 v49.21,75.06 | 49.37,44.58 49.37,38.07 50.16,37.28 50.16,35.69 51.44,34.42 51.44,33.15 50.8,32.51 50.16,32.51 49.3,31.65 R8.2 | v47.47,28.86 49.21,30.61
  Bottom 0.508: v49.21,50.32 50.01,49.66 50.01,45.21 | R6.2 45.09,63.63 v44.45,62.99
  Bottom 1.016: JP18.4 46.35,2.67 47.43,1.59 62.42,1.59 63.5,2.67 JP3.3
  Bottom 1.27: U$5.21 U$5.11 71.12,11.32 71.12,9.02 69.06,6.96 64.62,6.96 63.5,5.84 JP3.3
(copper drawn outside any net)
  shapes: Top area x2